# Altium project DSP-Control.PrjPcb
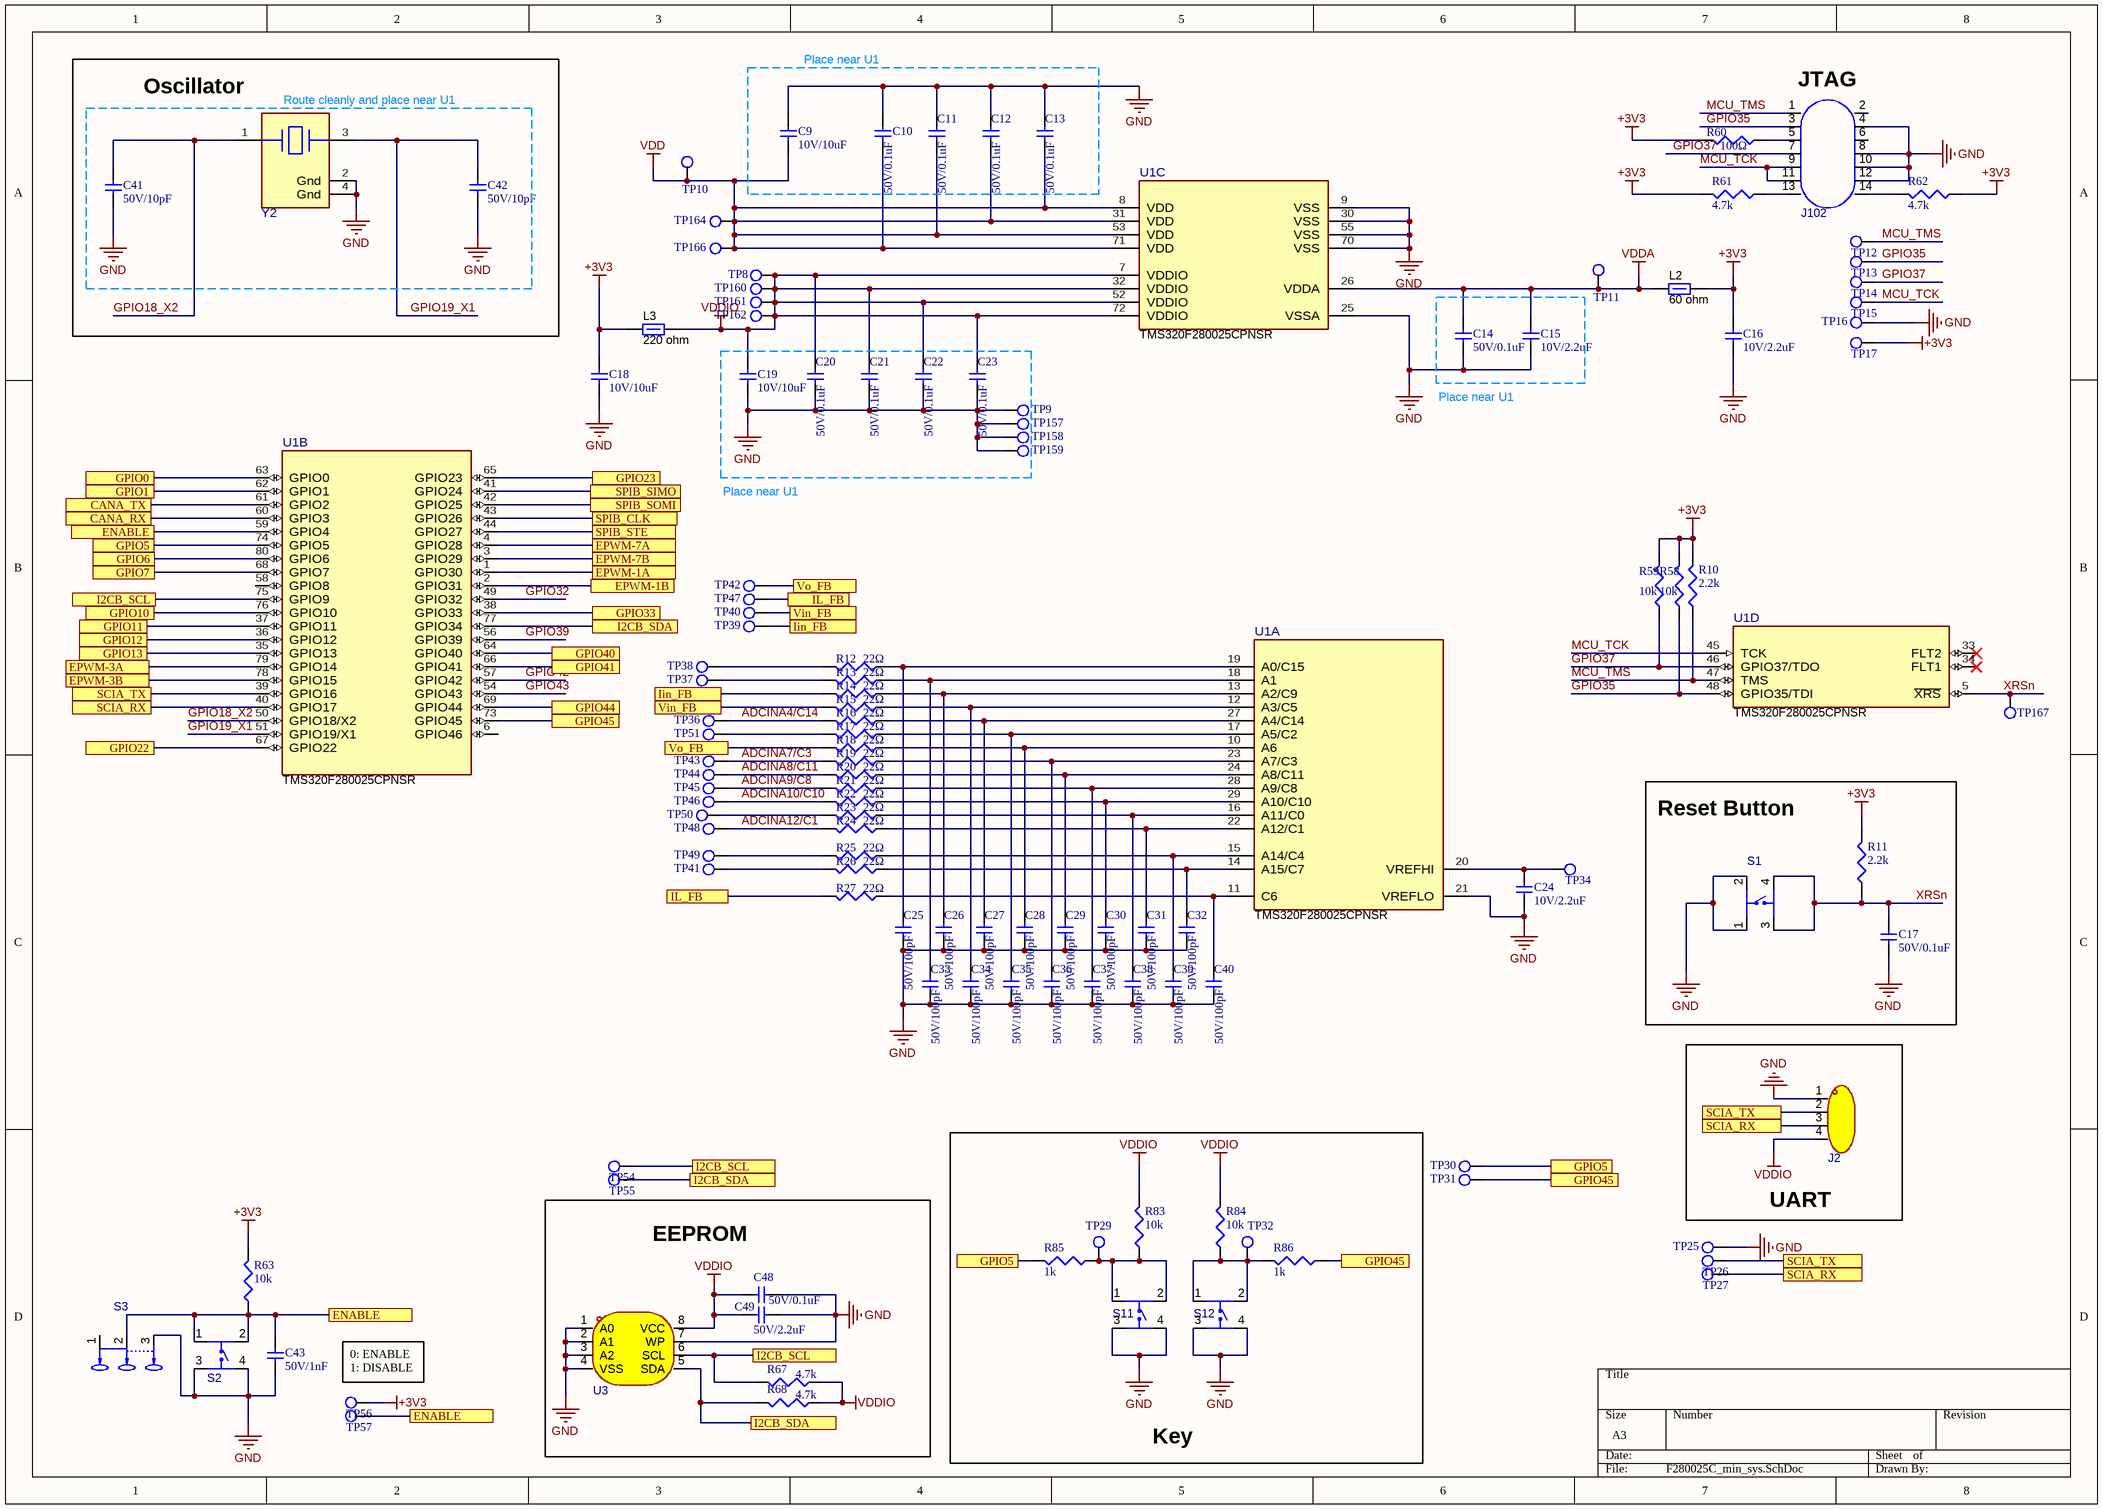
[diagram p0: F280025C_min_sys.SchDoc]
2 sheets, 225 parts. Net scope: global (net labels, ports and power ports of the same name join across sheets).
Board file: DSP_Control.PcbDoc
Sheets:
  F280025C_min_sys.SchDoc
  sys-part2.SchDoc

## Sheet F280025C_min_sys.SchDoc
size A3; SheetNumber: 1; SheetTotal: 2

### Parts
C9  10V/10uF  [C0603]
C10  50V/0.1uF  [C0603]
C11  50V/0.1uF  [C0603]
C12  50V/0.1uF  [C0603]
C13  50V/0.1uF  [C0603]
C14  50V/0.1uF  [C0603]
C15  10V/2.2uF  [C0603]
C16  10V/2.2uF  [C0603]
C17  50V/0.1uF  [C0603]
C18  10V/10uF  [C0603]
C19  10V/10uF  [C0603]
C20  50V/0.1uF  [C0603]
C21  50V/0.1uF  [C0603]
C22  50V/0.1uF  [C0603]
C23  50V/0.1uF  [C0603]
C24  10V/2.2uF  [C0603]
C25  50V/100pF  [C0603]
C26  50V/100pF  [C0603]
C27  50V/100pF  [C0603]
C28  50V/100pF  [C0603]
C29  50V/100pF  [C0603]
C30  50V/100pF  [C0603]
C31  50V/100pF  [C0603]
C32  50V/100pF  [C0603]
C33  50V/100pF  [C0603]
C34  50V/100pF  [C0603]
C35  50V/100pF  [C0603]
C36  50V/100pF  [C0603]
C37  50V/100pF  [C0603]
C38  50V/100pF  [C0603]
C39  50V/100pF  [C0603]
C40  50V/100pF  [C0603]
C41  50V/10pF  [C0603]
C42  50V/10pF  [C0603]
C43  50V/1nF  [C0603]
C48  50V/0.1uF  [C0603]
C49  50V/2.2uF  [C0805]
J2  pz254v-11-04p  [HDR-TH_4P-P2.54-V-M]  (value not drawn)
J102  2.54-2*7p简牛  [IDC-TH_14P-P2.54-V-R2-C7-S2.54]  (value not drawn)
L2  value 60 ohm  [L0805]  (hidden comment: 60Ω@100MHz)
L3  ValueDisplayed: 220 ohm  [L0805]  (hidden comment: 220Ω/100 MHz)
R10  2.2k  [R0603]
R11  2.2k  [R0603]
R12  22Ω  [R0603]
R13  22Ω  [R0603]
R14  22Ω  [R0603]
R15  22Ω  [R0603]
R16  22Ω  [R0603]
R17  22Ω  [R0603]
R18  22Ω  [R0603]
R19  22Ω  [R0603]
R20  22Ω  [R0603]
R21  22Ω  [R0603]
R22  22Ω  [R0603]
R23  22Ω  [R0603]
R24  22Ω  [R0603]
R25  22Ω  [R0603]
R26  22Ω  [R0603]
R27  22Ω  [R0603]
R58  10k  [R0603]
R59  10k  [R0603]
R60  100Ω  [R0603]
R61  4.7k  [R0603]
R62  4.7k  [R0603]
R63  10k  [R0603]
R67  4.7k  [R0603]
R68  4.7k  [R0603]
R83  10k  [R0603]
R84  10k  [R0603]
R85  1k  [R0603]
R86  1k  [R0603]
S1  kh-6x6x5h-stm  [SW-SMD_4P-L6.0-W6.0-P4.50-LS9.0_H5.0]  (value not drawn)
S2  kh-6x6x5h-stm  [SW-SMD_4P-L6.0-W6.0-P4.50-LS9.0_H5.0]  (value not drawn)
S3  ss-12d10l5  [SW-TH_SS-12D10L5]  (value not drawn)
S11  kh-6x6x5h-stm  [SW-SMD_4P-L6.0-W6.0-P4.50-LS9.0_H5.0]  (value not drawn)
S12  kh-6x6x5h-stm  [SW-SMD_4P-L6.0-W6.0-P4.50-LS9.0_H5.0]  (value not drawn)
TP8  TEST POINT  [TP-1.5]  (value not drawn)
TP9  TP-pad0.8  [PAD0.8/1.6]  (value not drawn)
TP10  TEST POINT  [TP-1.5]  (value not drawn)
TP11  TEST POINT  [TP-1.5]  (value not drawn)
TP12  TEST POINT  [TP-1.5]  (value not drawn)
TP13  TEST POINT  [TP-1.5]  (value not drawn)
TP14  TEST POINT  [TP-1.5]  (value not drawn)
TP15  TEST POINT  [TP-1.5]  (value not drawn)
TP16  TP-pad0.8  [PAD0.8/1.6]  (value not drawn)
TP17  TEST POINT  [TP-1.5]  (value not drawn)
TP25  TP-pad0.8  [PAD0.8/1.6]  (value not drawn)
TP26  TEST POINT  [TP-1.5]  (value not drawn)
TP27  TEST POINT  [TP-1.5]  (value not drawn)
TP29  TEST POINT  [TP-1.5]  (value not drawn)
TP30  TEST POINT  [TP-1.5]  (value not drawn)
TP31  TEST POINT  [TP-1.5]  (value not drawn)
TP32  TEST POINT  [TP-1.5]  (value not drawn)
TP34  TEST POINT  [TP-1.5]  (value not drawn)
TP36  TP-pad0.8  [PAD0.8/1.6]  (value not drawn)
TP37  TP-pad0.8  [PAD0.8/1.6]  (value not drawn)
TP38  TP-pad0.8  [PAD0.8/1.6]  (value not drawn)
TP39  TP-pad0.8  [PAD0.8/1.6]  (value not drawn)
TP40  TP-pad0.8  [PAD0.8/1.6]  (value not drawn)
TP41  TP-pad0.8  [PAD0.8/1.6]  (value not drawn)
TP42  TP-pad0.8  [PAD0.8/1.6]  (value not drawn)
TP43  TP-pad0.8  [PAD0.8/1.6]  (value not drawn)
TP44  TP-pad0.8  [PAD0.8/1.6]  (value not drawn)
TP45  TP-pad0.8  [PAD0.8/1.6]  (value not drawn)
TP46  TP-pad0.8  [PAD0.8/1.6]  (value not drawn)
TP47  TP-pad0.8  [PAD0.8/1.6]  (value not drawn)
TP48  TP-pad0.8  [PAD0.8/1.6]  (value not drawn)
TP49  TP-pad0.8  [PAD0.8/1.6]  (value not drawn)
TP50  TP-pad0.8  [PAD0.8/1.6]  (value not drawn)
TP51  TP-pad0.8  [PAD0.8/1.6]  (value not drawn)
TP54  TEST POINT  [TP-1.5]  (value not drawn)
TP55  TEST POINT  [TP-1.5]  (value not drawn)
TP56  TEST POINT  [TP-1.5]  (value not drawn)
TP57  TEST POINT  [TP-1.5]  (value not drawn)
TP157  TP-pad0.8  [PAD0.8/1.6]  (value not drawn)
TP158  TP-pad0.8  [PAD0.8/1.6]  (value not drawn)
TP159  TP-pad0.8  [PAD0.8/1.6]  (value not drawn)
TP160  TEST POINT  [TP-1.5]  (value not drawn)
TP161  TEST POINT  [TP-1.5]  (value not drawn)
TP162  TEST POINT  [TP-1.5]  (value not drawn)
TP164  TEST POINT  [TP-1.5]  (value not drawn)
TP166  TEST POINT  [TP-1.5]  (value not drawn)
TP167  TEST POINT  [TP-1.5]  (value not drawn)
U1  TMS320F280025CPNSR  [PN0080A-MFG]  (parts A,B,C,D of 4)
U3  24lc64t-i/sn  [SOIC-8_L4.9-W3.9-P1.27-LS6.0-BL]  (value not drawn)
Y2  20M  [CRYSTAL-SMD_4P-L3.2-W2.5-BL-2]  (value not drawn)

### Blocks framed on the sheet
Oscillator: C41 C42 Y2
Reset Button: C17 R11 S1
UART: J2
Key: R83-R86 S11 S12 TP29 TP32
EEPROM: C48 C49 R67 R68 U3

### Ports
CANA_RX, CANA_TX, ENABLE, EPWM-1A, EPWM-1B, EPWM-3A, EPWM-3B, EPWM-7A, EPWM-7B, GPIO0, GPIO1, GPIO5, GPIO6, GPIO7, GPIO10, GPIO11, GPIO12, GPIO13, GPIO22, GPIO23, GPIO33, GPIO40, GPIO41, GPIO44, GPIO45, I2CB_SCL, I2CB_SDA, Iin_FB, IL_FB, SCIA_RX, SCIA_TX, SPIB_CLK, SPIB_SIMO, SPIB_SOMI, SPIB_STE, Vin_FB, Vo_FB

### Nets
+3V3: C16.1 C18.1 L2.2 L3.1 R10.2 R11.2 R58.2 R59.2 R60.2 R61.2 R62.1 R63.2 TP17.1 TP56.1
GND: C9.1 C10.1 C11.1 C12.1 C13.1 C14.2 C15.2 C16.2 C17.2 C18.2 C19.2 C20.2 C21.2 C22.2 C23.2 C24.2 C25.2 C26.2 C27.2 C28.2 C29.2 C30.2 C31.2 C32.2 C33.2 C34.2 C35.2 C36.2 C37.2 C38.2 C39.2 C40.2 C41.2 C42.2 C43.2 C48.2 C49.2 J2.1 J102.4 J102.8 J102.10 J102.12 S1.1 S1.2 S2.3 S2.4 S3.3 S11.3 S11.4 S12.3 S12.4 TP9.1 TP16.1 TP25.1 TP157.1 TP158.1 TP159.1 U1.9(VSS) U1.21(VREFLO) U1.25(VSSA) U1.30(VSS) U1.55(VSS) U1.70(VSS) U3.1(A0) U3.2(A1) U3.3(A2) U3.4(VSS) U3.7(WP) Y2.2(Gnd) Y2.4(Gnd)
VDD: C9.2 C10.2 C11.2 C12.2 C13.2 TP10.1 TP164.1 TP166.1 U1.8(VDD) U1.31(VDD) U1.53(VDD) U1.71(VDD)
VDDA: C14.1 C15.1 L2.1 TP11.1 U1.26(VDDA)
VDDIO: C19.1 C20.1 C21.1 C22.1 C23.1 C48.1 C49.1 J2.4 L3.2 R67.1 R68.1 R83.2 R84.2 TP8.1 TP160.1 TP161.1 TP162.1 U1.7(VDDIO) U1.32(VDDIO) U1.52(VDDIO) U1.72(VDDIO) U3.8(VCC)
ADCINA4/C14: R16.2 TP36.1
ADCINA7/C3: R19.2 TP43.1
ADCINA8/C11: R20.2 TP44.1
ADCINA9/C8: R21.2 TP45.1
ADCINA10/C10: R22.2 TP46.1
ADCINA12/C1: R24.2 TP48.1
CANA_RX: U1.60(GPIO3) ; port CANA_RX
CANA_TX: U1.61(GPIO2) ; port CANA_TX
ENABLE: C43.1 R63.1 S2.1 S2.2 S3.2 TP57.1 U1.59(GPIO4) ; port ENABLE
EPWM-1A: U1.1(GPIO30) ; port EPWM-1A
EPWM-1B: U1.2(GPIO31) ; port EPWM-1B
EPWM-3A: U1.79(GPIO14) ; port EPWM-3A
EPWM-3B: U1.78(GPIO15) ; port EPWM-3B
EPWM-7A: U1.4(GPIO28) ; port EPWM-7A
EPWM-7B: U1.3(GPIO29) ; port EPWM-7B
GPIO0: U1.63(GPIO0) ; port GPIO0
GPIO1: U1.62(GPIO1) ; port GPIO1
GPIO5: R85.2 TP30.1 U1.74(GPIO5) ; port GPIO5
GPIO6: U1.80(GPIO6) ; port GPIO6
GPIO7: U1.68(GPIO7) ; port GPIO7
GPIO10: U1.76(GPIO10) ; port GPIO10
GPIO11: U1.37(GPIO11) ; port GPIO11
GPIO12: U1.36(GPIO12) ; port GPIO12
GPIO13: U1.35(GPIO13) ; port GPIO13
GPIO18_X2: C41.1 U1.50(GPIO18/X2) Y2.1(In/Out)
GPIO19_X1: C42.1 U1.51(GPIO19/X1) Y2.3(Out/In)
GPIO22: U1.67(GPIO22) ; port GPIO22
GPIO23: U1.65(GPIO23) ; port GPIO23
GPIO32: U1.49(GPIO32)
GPIO33: U1.38(GPIO33) ; port GPIO33
GPIO35: J102.3 R58.1 TP13.1 U1.48(GPIO35/TDI)
GPIO37: J102.7 R59.1 TP14.1 U1.46(GPIO37/TDO)
GPIO39: U1.56(GPIO39)
GPIO40: U1.64(GPIO40) ; port GPIO40
GPIO41: U1.66(GPIO41) ; port GPIO41
GPIO42: U1.57(GPIO42)
GPIO43: U1.54(GPIO43)
GPIO44: U1.69(GPIO44) ; port GPIO44
GPIO45: R86.1 TP31.1 U1.73(GPIO45) ; port GPIO45
I2CB_SCL: R67.2 TP54.1 U1.75(GPIO9) U3.6(SCL) ; port I2CB_SCL
I2CB_SDA: R68.2 TP55.1 U1.77(GPIO34) U3.5(SDA) ; port I2CB_SDA
Iin_FB: R14.2 TP39.1 ; port Iin_FB
IL_FB: R27.2 TP47.1 ; port IL_FB
MCU_TCK: J102.9 J102.11 TP15.1 U1.45(TCK)
MCU_TMS: J102.1 R10.1 TP12.1 U1.47(TMS)
SCIA_RX: J2.3 TP27.1 U1.40(GPIO17) ; port SCIA_RX
SCIA_TX: J2.2 TP26.1 U1.39(GPIO16) ; port SCIA_TX
SPIB_CLK: U1.43(GPIO26) ; port SPIB_CLK
SPIB_SIMO: U1.41(GPIO24) ; port SPIB_SIMO
SPIB_SOMI: U1.42(GPIO25) ; port SPIB_SOMI
SPIB_STE: U1.44(GPIO27) ; port SPIB_STE
Vin_FB: R15.2 TP40.1 ; port Vin_FB
Vo_FB: R18.2 TP42.1 ; port Vo_FB
XRSn: C17.1 R11.1 S1.3 S1.4 TP167.1 U1.5(~{XRS})
NetC24_1: C24.1 TP34.1 U1.20(VREFHI)
NetC25_1: C25.1 R12.1 U1.19(A0/C15)
NetC26_1: C26.1 R14.1 U1.13(A2/C9)
NetC27_1: C27.1 R16.1 U1.27(A4/C14)
NetC28_1: C28.1 R18.1 U1.10(A6)
NetC29_1: C29.1 R20.1 U1.24(A8/C11)
NetC30_1: C30.1 R22.1 U1.29(A10/C10)
NetC31_1: C31.1 R24.1 U1.22(A12/C1)
NetC32_1: C32.1 R26.1 U1.14(A15/C7)
NetC33_1: C33.1 R13.1 U1.18(A1)
NetC34_1: C34.1 R15.1 U1.12(A3/C5)
NetC35_1: C35.1 R17.1 U1.17(A5/C2)
NetC36_1: C36.1 R19.1 U1.23(A7/C3)
NetC37_1: C37.1 R21.1 U1.28(A9/C8)
NetC38_1: C38.1 R23.1 U1.16(A11/C0)
NetC39_1: C39.1 R25.1 U1.15(A14/C4)
NetC40_1: C40.1 R27.1 U1.11(C6)
NetJ102_5: J102.5 R60.1
NetJ102_13: J102.13 R61.1
NetJ102_14: J102.14 R62.2
NetR12_2: R12.2 TP38.1
NetR13_2: R13.2 TP37.1
NetR17_2: R17.2 TP51.1
NetR23_2: R23.2 TP50.1
NetR25_2: R25.2 TP49.1
NetR26_2: R26.2 TP41.1
NetR83_1: R83.1 R85.1 S11.1 S11.2 TP29.1
NetR84_1: R84.1 R86.2 S12.1 S12.2 TP32.1

Not connected (* = marked no-connect by the designer): J102 2 6; S3 1; U1 6(GPIO46) 33(FLT2)* 34(FLT1)* 58(GPIO8)

### Notes on the sheet
- (near Y2) Route cleanly and place near U1
- Place near U1
- (near J102) JTAG
- 0: ENABLE
- 1: DISABLE

### Library data of the parts
C9 C18 C19 = C0603-10V/10uF: 0603,10V/10uF
C10-C14 C17 C20-C23 C48 = C0603-50V/104: 0603,50V/104
C15 C16 C24 = C0603-10V/2.2uF: 0603,10V/2.2uF
C25-C40 = C0603-50V/100pF: 0603,50V/100pF
C41 C42 = C0603-50V/10pF: 0603,50V/10pF,C0G/NP0
C43 = C0603-50V/1nF: 0603,50V/1nF
C49 = C0805-50V/2.2uF: 0805,50V/2.2uF,
J2 = pz254v-11-04p: 插针结构:1x4P;间距:2.54mm;行距:-;圆针/方针:方针;安装方式:直插;排数:单排;总PIN位数:4P;额定电流:3A;额定电压:250V;配合针长度:6mm;塑高:2.5mm;端接针长度:3mm;触头材质:-;工作温度:-40℃~+105℃;颜色:黑色;; Manufacturer: XFCN(兴飞); Symbol: PZ254V-11-04P_C2691448; AddInBom: yes; ModelId: 112f4d05e8d64e99ab9a333894bea4f9; ModelName: HDR-TH_4P-P2.54-M-LI-1X4P; ModelTransform: 399.999,104.7242,0,0,0,0,0,0,-118.11; Pin Structure: 1x4P; Pitch: 2.54mm; Circluar Pins/Square Pins: 方针; Current Rating: 3A; Voltage Rating (Max): 250V; LCSC Part Name: 1x4P 间距:2.54mm 方针 直插; SupplierPart: C2691448; ManufacturerPart: PZ254V-11-04P; Supplier Footprint: 插件,P=2.54mm; JLCPCB Part Class: Extended Part; Datasheet: https://item.szlcsc.com/datasheet/PZ254V-11-04P/2801085.html; Supplier: LCSC; ConvertToPcb: yes; FootprintName: HDR-TH_4P-P2.54-V-M; Row Spacing: -; Mounting Type: 直插; Number of Rows: 单排; Number of Pins: 4P; Length of Mating Pin: 6mm; Insulation Height: 2.5mm; Length of End Connection Pin: 3mm; Contact Material: -; Operating Temperature: -40℃~+105℃; Color: 黑色
J102 = 2.54-2*7p简牛: 连接器类型:简牛座;间距:2.54mm;结构:2x7P;安装方式:直插;行距:2.54mm;排数:2;每排PIN数:7;触头材质:黄铜;触头镀层:金;; Manufacturer: BOOMELE(博穆精密); Symbol: HDR-IDC-2.54-2X7P; AddInBom: yes; ModelId: 1e191473481d43b08e40c7df32061c8c; ModelTransform: 999.998,348.41478,0,0,0,0,0,3.937,-118.11; Connector Type: 简牛座; Pitch: 2.54mm; Number of Positions or Pins: 2x7P; Holder Type: 直插; Number of PINs Per Row: 7; LCSC Part Name: 2.54mm 2x7P 排数:2 每排P数:7; SupplierPart: C11215; ManufacturerPart: 2.54-2*7P简牛; Supplier Footprint: 插件,P=2.54mm; JLCPCB Part Class: Extended Part; Datasheet: https://item.szlcsc.com/datasheet/2.54-2*7P%25E7%25AE%2580%25E7%2589%259B/11764.html; Supplier: LCSC; ConvertToPcb: yes; FootprintName: IDC-TH_14P-P2.54-V-R2-C7-S2.54; ModelName: IDC-TH_14P-P2.54-V-R2-C7-S2.54; Row Spacing: 2.54mm; Number of Rows: 2; Contact Material: 黄铜; Contact Plating: 金
L2 = 磁珠-60Ω@100MHz: 磁珠,60Ω@100MHz,3A,0805,CBW201209U600T,风华; Manufacturer: Wurth Elektronik; PartNumber: 742792063; Ztyp@1GHz_Ohm: 95.384; ZTyp@100MHz_Ohm: 60; SizeAreaWB_mm2: 6.75; DCR_ohm: 0.025; Value1: 0.025 ohm; SizeZ_mm: 1.45; SizeX_mm: 2; SizeY_mm: 1.25; SizeArea_mm2: 2.5; CompType: Ferrite Bead; ComponentLink1URL: http://katalog.we-online.de/pbs/datasheet/742792063.pdf; Supplier Part Number 2: 710-742792063; Publisher: Texas Instruments; Supplier 2: Mouser; Published: 2014-04-30; RoHS: Y; MountType: SMT; Supplier 1: Digi-Key; PackageReference: 0805; Imax_A: 3A; Value2: 3A; LatestRevisionDate: 2017-03-09; ComponentLink1Description: Datasheet link; Supplier Part Number 1: 732-1612-1-ND; ValueDisplayed: 60 ohm
L3 = 磁珠-220Ω-100MHz-2A: 磁珠 220Ω @ 100 MHz, 2 A, 0805,BLM21PG221SN1D，村田; Manufacturer: Wurth Elektronik; PartNumber: 742792022; Ztyp@1GHz_Ohm: 190.289; ZTyp@100MHz_Ohm: 220; SizeAreaWB_mm2: 6.75; DCR_ohm: 0.05; Value1: 0.05 ohm; Value: 220 ohm; Imax_A: 2A; SizeZ_mm: 1.45; SizeX_mm: 2; SizeY_mm: 1.25; SizeArea_mm2: 2.5; CompType: Ferrite Bead; ComponentLink1URL: http://katalog.we-online.de/pbs/datasheet/742792022.pdf; Supplier Part Number 2: 710-742792022; Publisher: Texas Instruments; Supplier 2: Mouser; Published: 2014-04-30; RoHS: Y; MountType: SMT; Supplier 1: Digi-Key; PackageReference: 0805; Value2: 2A; LatestRevisionDate: 2017-03-09; ComponentLink1Description: Datasheet link; Supplier Part Number 1: 732-1614-1-ND
R10 R11 = R0603-2.2k: 0603,2.2k
R12-R27 = R0603-22Ω: 0603,22Ω
R58 R59 R63 R83 R84 = R0603-10k: 0603,10k
R60 = R0603-100Ω: 0603,100Ω
R61 R62 R67 R68 = R0603-4.7k: 0603,4.7k
R85 R86 = R0603-1k: 0603,1k
S1 S2 S11 S12 = kh-6x6x5h-stm: 电路结构:单刀单掷;按钮形状:圆形按钮;安装方式:立贴;开关长度:6mm;开关宽度:6mm;开关高度:5mm;带支架:不带支架;触点电流:50mA;额定电压:12V;工作寿命:8万次;; Manufacturer: kinghelm(金航标); AddInBom: yes; ModelId: 46371efb35684031937580a0045530ec; ModelTransform: 354.33,236.25937,0,0,0,0,0,0,0; Circuit: 单刀单掷; Actuator Style: 圆形按钮; Switch Height: 5mm; with Bracket: 不带支架; Contact Current: 50mA; Voltage Rating: 12V; Actuator/Cap Color: 黑色; Life: 8万次; Symbol: KH-6X6X5H-STM; LCSC Part Name: 6*6*5mm 立贴 轻触开关; SupplierPart: C2837531; ManufacturerPart: KH-6X6X5H-STM; Supplier Footprint: SMD-4P,6x6mm; JLCPCB Part Class: Extended Part; Datasheet: https://item.szlcsc.com/datasheet/KH-6X6X5H-STM/3009601.html; Supplier: LCSC; ConvertToPcb: yes; FootprintName: SW-SMD_4P-L6.0-W6.0-P4.50-LS9.0_H5.0; ModelName: SW-SMD_4P-L6.0-W6.0-P4.50-LS9.0_H5.0; Mounting Type: 立贴; Length: 6mm; Width: 6mm; Termination Style: 鸥翼型
S3 = ss-12d10l5: 电路结构:单刀双掷;安装方式:直插;开关颜色:黑色;额定电流:3A;额定电压:125V;工作寿命:1万次;; Manufacturer: XKB Connection(中国星坤); AddInBom: yes; ModelId: c49f07a32c154ec8ad7cf47670a53981; ModelName: SW-TH_L13.0-W6.8-H6.4-P4.7; ModelTransform: 511.81394,267.716,0,0,0,0,0,0,-220.472; Circuit: 单刀双掷; Actuator Style: 矩形柱状; Switch Height: 6.4mm; Actuator Color: 黑色; Current Rating: 3A; Voltage Rating: 125V; Life: 1万次; Symbol: SS-12D10L5; LCSC Part Name: 柄长5mm 直插双档 滑动开关; SupplierPart: C319012; ManufacturerPart: SS-12D10L5; Supplier Footprint: 插件,13x6.8mm; JLCPCB Part Class: Extended Part; Datasheet: https://item.szlcsc.com/datasheet/SS-12D10L5/300104.html; Supplier: LCSC; ConvertToPcb: yes; FootprintName: SW-TH_SS-12D10L5; Termination Style: PC引脚; Length: 13mm; Width: 6.8mm; Mounting Type: 直插; Operating Temperature: -40℃~+85℃
U1 = SYM-TMS320F280025CPNSR: 32-bit MCU with 100 MHz, FPU, TMU, 128-KB flash, CLB 80-LQFP -40 to 125; Manufacturer: Texas Instruments; TJmax_C: +125°C; Number Of Spi Channels: 2; CompType: IC; Max Supply Voltage: 3.63V; Number Of Pwm Channels: 14; AEC Qualified: No; Memory Size: 128KBytes; Interface: I2C,SPI,UART,CAN,LIN,SCI,Other; Min Supply Voltage: 2.8V; SizeZ_mm: 1.6mm; Number Of Adc Channels: 16; Number Of Timers/Counters: 3; Ram Size: 24KBytes; Number Of Cores: 1; Frequency_Fixed: 100MHz; Number Of I/Os: 43; Data Bus Width: 32bits; Standoff Height: 0.05mm; Core Architecture: TMS320C28x; AEC Category: Q200; TaMin_C: -40°C; Number Of A/D Converters: 2; helpURL: https://upverter.com/upn/revision/e6f10be0003e77e0/; ComponentLink3Description: Online Datasheet; Memory Type: FLASH; ComponentLink3URL: http://www.ti.com/product/GPN/datasheet; ComponentLink1Description: Datasheet Link; ComponentLink2Description: Product Folder; Operating Temperature Range: -40°C to +125°C; Datasheet Path: datasheets/IC-TMS320F280025CPNSR.pdf; Number Of Uart Channels: 1; RoHS: UNKNOWN; Number Of I2C Channels: 2; TaMax_C: +125°C; PackageReference: LQFP80; Part Number: TMS320F280025CPNSR; ComponentLink1URL: http://www.ti.com/lit/ds/symlink/GPN.pdf; ComponentLink2URL: http://www.ti.com/product/GPN; PartId: 1; PartNumber: TMS320F280025CPNSR
U3 = 24lc64t-i/sn: 接口类型:I2C;存储容量:64Kbit;时钟频率(fc):400kHz;; Manufacturer: MICROCHIP(美国微芯); Symbol: 24LC64T-I/SN SOP-8; AddInBom: yes; ModelId: e81d2f7d937b4a6ab1dca543ff5d56a4; ModelName: SOIC-8_L4.9-W3.9-H1.7-LS6.0-P1.27; ModelTransform: 192.913,236.22,0,0,0,0,0,0,0; Interface: I2C; Memory Size: 64Kbit; Clock Frequency: 400kHz; Write Cycle Time(Tw): 5ms; Data Retention - TDR (Year): 200年; Write Cycle Endurance: 100万次; Voltage - Supply: 2.5V~5.5V; LCSC Part Name: 64K I²C 串行 EEPROM; SupplierPart: C5460; ManufacturerPart: 24LC64T-I/SN; Supplier Footprint: SOIC-8; JLCPCB Part Class: Extended Part; Datasheet: https://item.szlcsc.com/datasheet/24LC64T-I%252FSN/5911.html; Supplier: LCSC; ConvertToPcb: yes; FootprintName: SOIC-8_L4.9-W3.9-P1.27-LS6.0-BL; Features: 噪声抑制功能；硬件写保护功能; Operating Temperature: -40℃~+85℃
Y2 = 晶振-20M-X322520MSB4SI: 20M,X322520MSB4SI,扬兴,SMD3225-4P,常温频差:±10ppm;负载电容:20pF;频率稳定度:±20ppm;; PartNumber: ECS-200-8-30B-CKM; Manufacturer: ECS International; Tolerance_%: 10ppm; Frequency_Fixed: 20MHz; Esr: 40; AEC Qualified: No; Load Capacitance: 8pF; SizeZ_mm: 0.85mm; Datasheet Path: datasheets/Crys-ECS-200-8-30B-CKM.pdf; ComponentLink1URL: https://ecsxtal.com/store/pdf/ecx_53b.pdf; Supplier Part Number 1: XC1841CT-ND; Operating Temperature Range: -20°C to +70°C; PackageReference: SMD4; Mouser Part Number: 520-200-8-30B-CKM; ComponentLink1Description: Datasheet; Part Number: ECS-200-8-30B-CKM; Digikey Description: CRYSTAL 20.0000MHZ 8PF SMD; Supplier 2: Mouser; Mouser Description: Crystals 20.000MHZ 8pF 10ppm -20C +70C; Supplier 1: Digikey; Frequency Stability: 10ppm; datasheet: https://ecsxtal.com/store/pdf/ecx_53b.pdf; Frequency Tolerance: 10ppm; Digikey Part Number: XC1841CT-ND; Lead Free: Yes; helpURL: https://upverter.com/upn/revision/b9ae4a09c701963d/; RoHS: TRUE; Series: ECX-53B; Supplier Part Number 2: 520-200-8-30B-CKM

## Sheet sys-part2.SchDoc
size A3; SheetNumber: 2; SheetTotal: 2
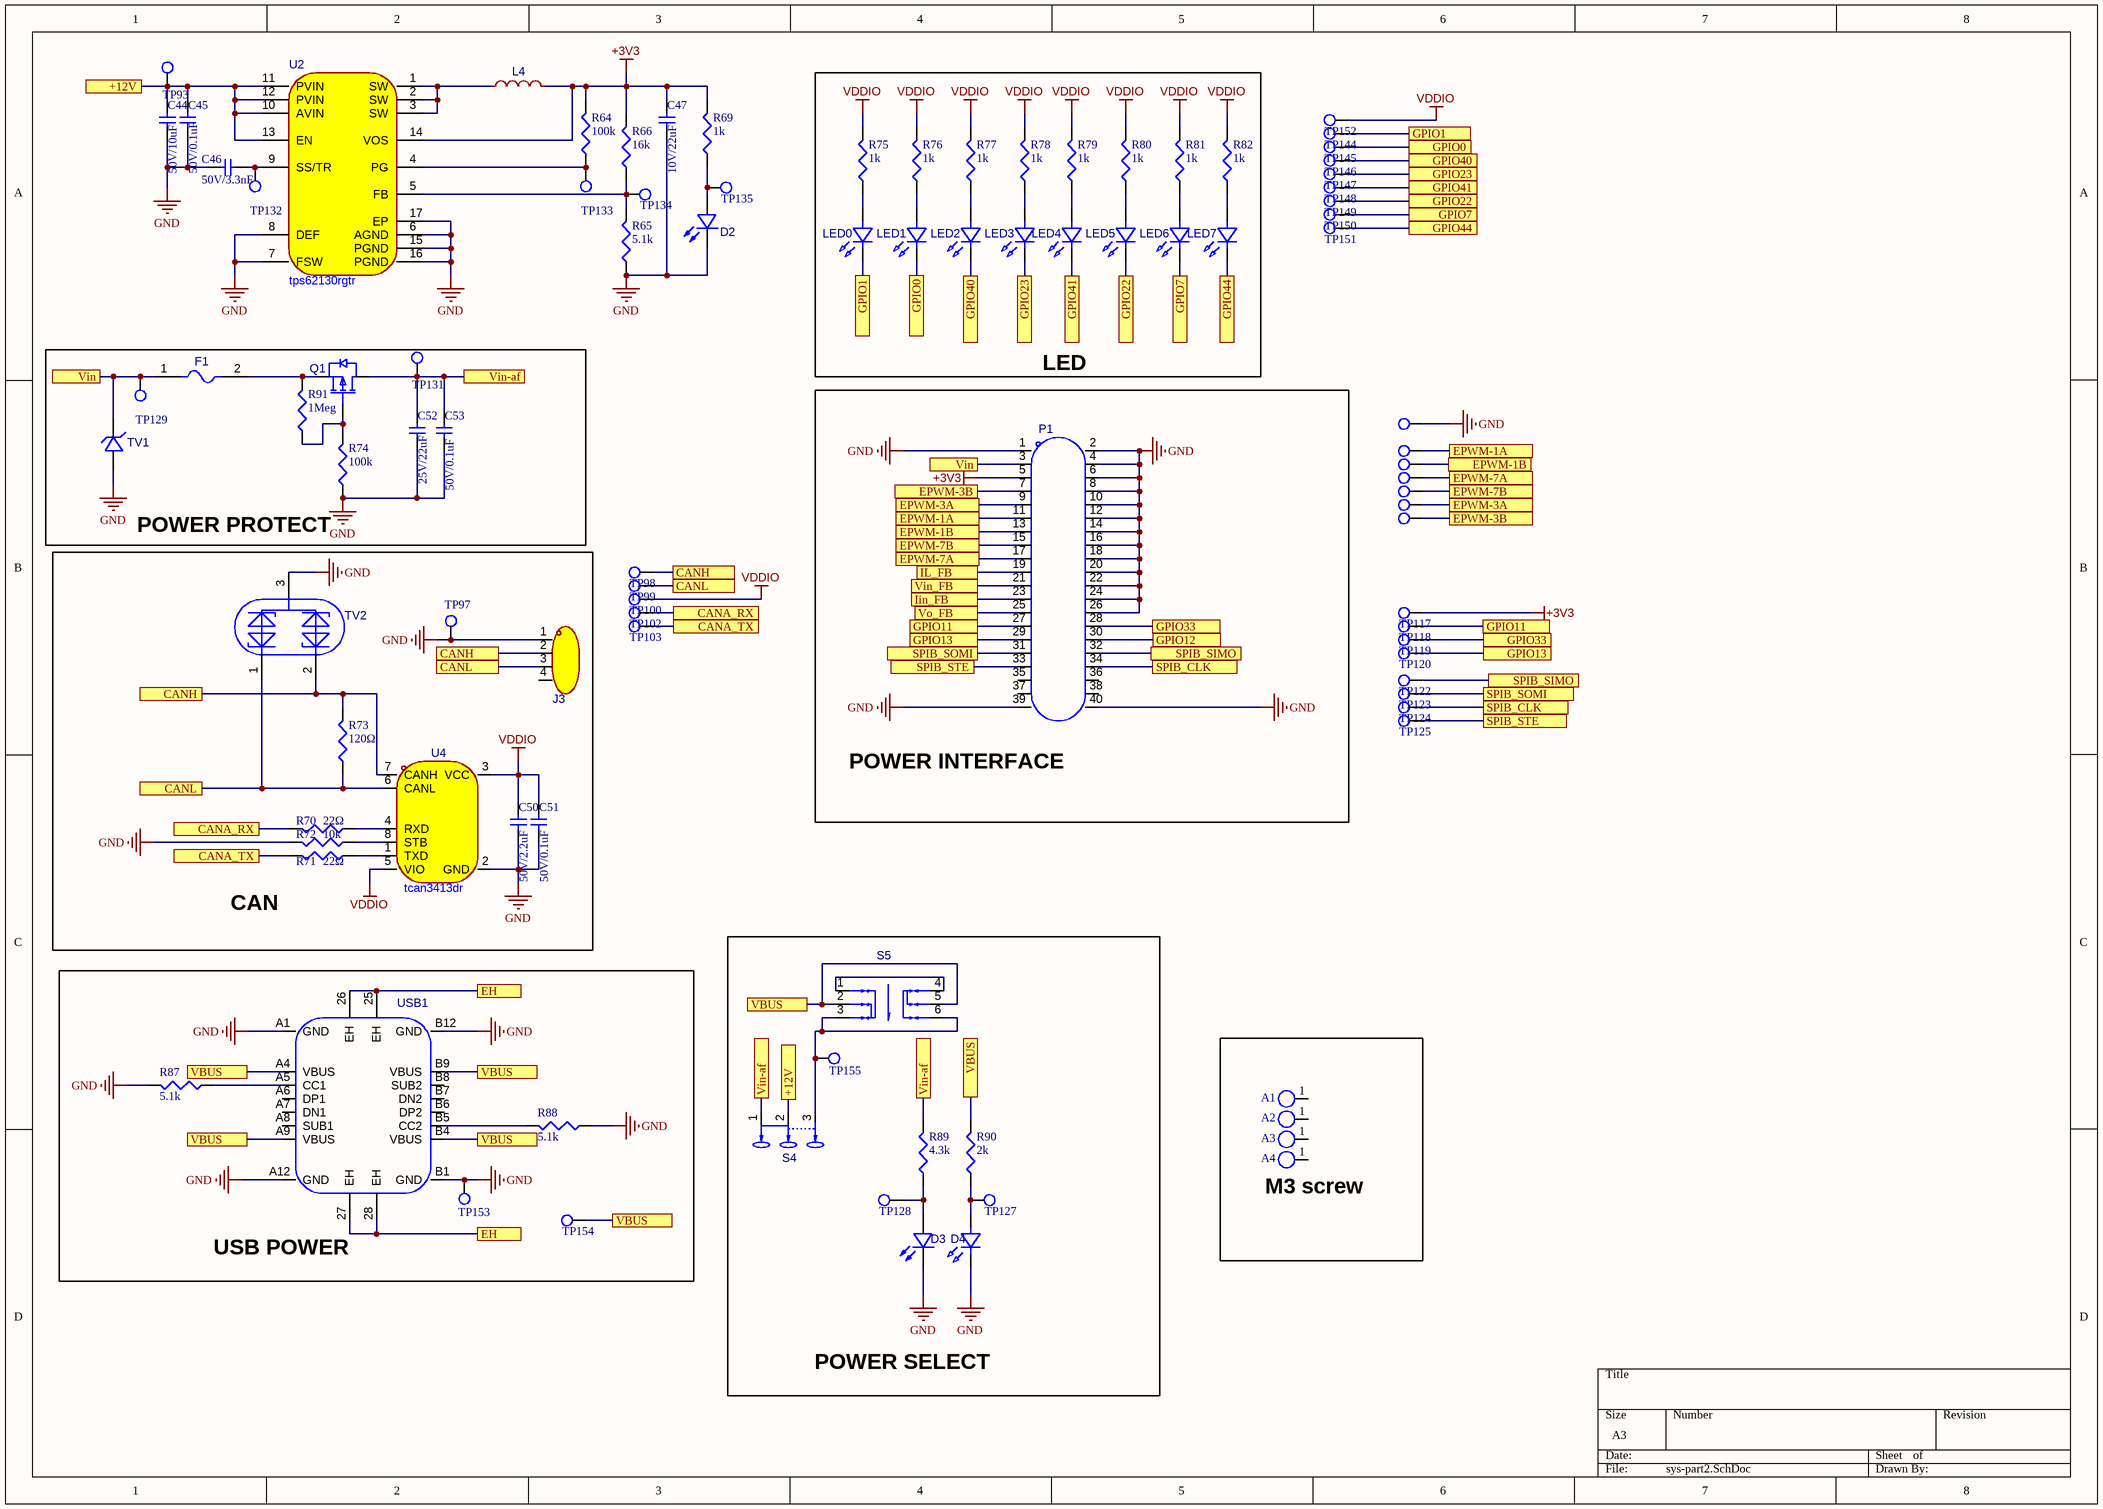
[diagram p1: sys-part2.SchDoc]

### Parts
A1  PAD-3.2/6.0  [PAD-3.2/6.0]  (value not drawn)
A2  PAD-3.2/6.0  [PAD-3.2/6.0]  (value not drawn)
A3  PAD-3.2/6.0  [PAD-3.2/6.0]  (value not drawn)
A4  PAD-3.2/6.0  [PAD-3.2/6.0]  (value not drawn)
C44  50V/10uF  [C0805]
C45  50V/0.1uF  [C0603]
C46  50V/3.3nF  [C0603]
C47  10V/22uF  [C0603]
C50  50V/2.2uF  [C0805]
C51  50V/0.1uF  [C0603]
C52  25V/22uF  [C0805]
C53  50V/0.1uF  [C0603]
D2  ncd0805c1  [LED0805-RD]  (value not drawn)
D3  ncd0805c1  [LED0805-RD]  (value not drawn)
D4  xl-2012surc  [LED0805-RD_RED]  (value not drawn)
F1  nsmd050-24v  [F1206]  (value not drawn)
J3  db125-3.81-4p-gn-s  [CONN-TH_DB125-3.81-4P]  (value not drawn)
L4  fhd4020s-3r3mt  [IND-SMD_L4.0-W4.0]  (value not drawn)
LED0  xl-2012surc  [LED0805-RD_RED]  (value not drawn)
LED1  xl-2012surc  [LED0805-RD_RED]  (value not drawn)
LED2  xl-2012surc  [LED0805-RD_RED]  (value not drawn)
LED3  xl-2012surc  [LED0805-RD_RED]  (value not drawn)
LED4  xl-2012surc  [LED0805-RD_RED]  (value not drawn)
LED5  xl-2012surc  [LED0805-RD_RED]  (value not drawn)
LED6  xl-2012surc  [LED0805-RD_RED]  (value not drawn)
LED7  xl-2012surc  [LED0805-RD_RED]  (value not drawn)
P1  zx-pm2.54-2-20py  [HDR-TH_40P-P2.54-V-F-R2-C20-S2.54]  (value not drawn)
Q1  ao3407a_c15155  [SOT-23-3_L2.9-W1.6-P1.90-LS2.8-BR]  (value not drawn)
R64  100k  [R0603]
R65  5.1k  [R0603]
R66  16k  [R0603]
R69  1k  [R0603]
R70  22Ω  [R0603]
R71  22Ω  [R0603]
R72  10k  [R0603]
R73  120Ω  [R0603]
R74  100k  [R0603]
R75  1k  [R0603]
R76  1k  [R0603]
R77  1k  [R0603]
R78  1k  [R0603]
R79  1k  [R0603]
R80  1k  [R0603]
R81  1k  [R0603]
R82  1k  [R0603]
R87  5.1k  [R0603]
R88  5.1k  [R0603]
R89  4.3k  [R0603]
R90  2k  [R0603]
R91  1Meg  [R0603]
S4  ss-12d10l5  [SW-TH_SS-12D10L5]  (value not drawn)
S5  xkb8080-z  [SW-TH_6P-L8.0-W8.0-P2.50]  (value not drawn)
TP93  TEST POINT  [TP-1.5]  (value not drawn)
TP97  TP-pad0.8  [PAD0.8/1.6]  (value not drawn)
TP98  TEST POINT  [TP-1.5]  (value not drawn)
TP99  TEST POINT  [TP-1.5]  (value not drawn)
TP100  TEST POINT  [TP-1.5]  (value not drawn)
TP102  TEST POINT  [TP-1.5]  (value not drawn)
TP103  TEST POINT  [TP-1.5]  (value not drawn)
TP104  TP-pad0.8  [PAD0.8/1.6]  (value not drawn)
TP105  TP-pad0.8  [PAD0.8/1.6]  (value not drawn)
TP106  TP-pad0.8  [PAD0.8/1.6]  (value not drawn)
TP107  TP-pad0.8  [PAD0.8/1.6]  (value not drawn)
TP108  TP-pad0.8  [PAD0.8/1.6]  (value not drawn)
TP109  TP-pad0.8  [PAD0.8/1.6]  (value not drawn)
TP110  TP-pad0.8  [PAD0.8/1.6]  (value not drawn)
TP117  TEST POINT  [TP-1.5]  (value not drawn)
TP118  TEST POINT  [TP-1.5]  (value not drawn)
TP119  TEST POINT  [TP-1.5]  (value not drawn)
TP120  TEST POINT  [TP-1.5]  (value not drawn)
TP122  TEST POINT  [TP-1.5]  (value not drawn)
TP123  TEST POINT  [TP-1.5]  (value not drawn)
TP124  TEST POINT  [TP-1.5]  (value not drawn)
TP125  TEST POINT  [TP-1.5]  (value not drawn)
TP127  TEST POINT  [TP-1.5]  (value not drawn)
TP128  TEST POINT  [TP-1.5]  (value not drawn)
TP129  TEST POINT  [TP-1.5]  (value not drawn)
TP131  TEST POINT  [TP-1.5]  (value not drawn)
TP132  TEST POINT  [TP-1.5]  (value not drawn)
TP133  TEST POINT  [TP-1.5]  (value not drawn)
TP134  TEST POINT  [TP-1.5]  (value not drawn)
TP135  TEST POINT  [TP-1.5]  (value not drawn)
TP144  TEST POINT  [TP-1.5]  (value not drawn)
TP145  TEST POINT  [TP-1.5]  (value not drawn)
TP146  TEST POINT  [TP-1.5]  (value not drawn)
TP147  TEST POINT  [TP-1.5]  (value not drawn)
TP148  TEST POINT  [TP-1.5]  (value not drawn)
TP149  TEST POINT  [TP-1.5]  (value not drawn)
TP150  TEST POINT  [TP-1.5]  (value not drawn)
TP151  TEST POINT  [TP-1.5]  (value not drawn)
TP152  TEST POINT  [TP-1.5]  (value not drawn)
TP153  TP-pad0.8  [PAD0.8/1.6]  (value not drawn)
TP154  TEST POINT  [TP-1.5]  (value not drawn)
TP155  TP-pad0.8  [PAD0.8/1.6]  (value not drawn)
TV1  smbj15a_c83846  [SMB_L4.6-W3.6-LS5.3-RD]  (value not drawn)
TV2  pesd1can,215  [SOT-23_L2.9-W1.3-P1.90-LS2.4-BR]  (value not drawn)
U2  tps62130rgtr  [QFN-16_L3.0-W3.0-P0.50-TL-EP1.7]
U4  tcan3413dr  [SOP-8_L4.9-W3.9-P1.27-LS6.0-BL-1]
USB1  type-c 16p cb1.6 073  [USB-C-SMD_SHOU_TYPE-C-16P-CB1.6]  (value not drawn)

### Blocks framed on the sheet
LED: LED0-LED7 R75-R82
POWER PROTECT: C52 C53 F1 Q1 R74 R91 TP129 TP131 TV1
POWER INTERFACE: P1
CAN: C50 C51 J3 R70-R73 TP97 TV2 U4
USB POWER: R87 R88 TP153 TP154 USB1
POWER SELECT: D3 D4 R89 R90 S4 S5 TP127 TP128 TP155
M3 screw: A1-A4

### Ports
+12V, CANA_RX, CANA_TX, CANH, CANL, EH, EPWM-1A, EPWM-1B, EPWM-3A, EPWM-3B, EPWM-7A, EPWM-7B, GPIO0, GPIO1, GPIO7, GPIO11, GPIO12, GPIO13, GPIO22, GPIO23, GPIO33, GPIO40, GPIO41, GPIO44, Iin_FB, IL_FB, SPIB_CLK, SPIB_SIMO, SPIB_SOMI, SPIB_STE, VBUS, Vin, Vin-af, Vin_FB, Vo_FB

### Nets
+3V3: C47.1 L4.2 P1.5 R64.2 R66.2 R69.2 TP117.1 U2.14(VOS)
GND: C44.2 C45.2 C46.1 C47.2 C50.2 C51.2 C52.2 C53.2 D2.1(K) D3.1(K) D4.1(K) J3.1 P1.1 P1.2 P1.4 P1.6 P1.8 P1.10 P1.12 P1.14 P1.16 P1.18 P1.20 P1.22 P1.24 P1.26 P1.39 P1.40 R65.1 R72.2 R74.1 R87.2 R88.1 TP97.1 TP104.1 TP153.1 TV1.2 TV2.3 U2.6(AGND) U2.7(FSW) U2.8(DEF) U2.15(PGND) U2.16(PGND) U2.17(EP) U4.2(GND) USB1.A1(GND) USB1.A12(GND) USB1.B1(GND) USB1.B12(GND)
VDDIO: C50.1 C51.1 R75.2 R76.2 R77.2 R78.2 R79.2 R80.2 R81.2 R82.2 TP100.1 TP152.1 U4.3(VCC) U4.5(VIO)
+12V: C44.1 C45.1 S4.2 TP93.1 U2.10(AVIN) U2.11(PVIN) U2.12(PVIN) U2.13(EN) ; port +12V
CANA_RX: R70.2 TP102.1 ; port CANA_RX
CANA_TX: R71.2 TP103.1 ; port CANA_TX
CANH: J3.2 R73.2 TP98.1 TV2.2 U4.7(CANH) ; port CANH
CANL: J3.3 R73.1 TP99.1 TV2.1 U4.6(CANL) ; port CANL
EH: USB1.25(EH) USB1.26(EH) USB1.27(EH) USB1.28(EH) ; port EH
EPWM-1A: P1.11 TP105.1 ; port EPWM-1A
EPWM-1B: P1.13 TP106.1 ; port EPWM-1B
EPWM-3A: P1.9 TP109.1 ; port EPWM-3A
EPWM-3B: P1.7 TP110.1 ; port EPWM-3B
EPWM-7A: P1.17 TP107.1 ; port EPWM-7A
EPWM-7B: P1.15 TP108.1 ; port EPWM-7B
GPIO0: LED1.1(K) TP145.1 ; port GPIO0
GPIO1: LED0.1(K) TP144.1 ; port GPIO1
GPIO7: LED6.1(K) TP150.1 ; port GPIO7
GPIO11: P1.27 TP118.1 ; port GPIO11
GPIO12: P1.30 ; port GPIO12
GPIO13: P1.29 TP120.1 ; port GPIO13
GPIO22: LED5.1(K) TP149.1 ; port GPIO22
GPIO23: LED3.1(K) TP147.1 ; port GPIO23
GPIO33: P1.28 TP119.1 ; port GPIO33
GPIO40: LED2.1(K) TP146.1 ; port GPIO40
GPIO41: LED4.1(K) TP148.1 ; port GPIO41
GPIO44: LED7.1(K) TP151.1 ; port GPIO44
Iin_FB: P1.23 ; port Iin_FB
IL_FB: P1.19 ; port IL_FB
SPIB_CLK: P1.34 TP124.1 ; port SPIB_CLK
SPIB_SIMO: P1.32 TP122.1 ; port SPIB_SIMO
SPIB_SOMI: P1.31 TP123.1 ; port SPIB_SOMI
SPIB_STE: P1.33 TP125.1 ; port SPIB_STE
VBUS: R90.2 S5.2 S5.5 TP154.1 USB1.A4(VBUS) USB1.A9(VBUS) USB1.B4(VBUS) USB1.B9(VBUS) ; port VBUS
Vin: F1.1 P1.3 TP129.1 TV1.1 ; port Vin
Vin-af: C52.1 C53.1 Q1.3(D) R89.2 S4.1 TP131.1 ; port Vin-af
Vin_FB: P1.21 ; port Vin_FB
Vo_FB: P1.25 ; port Vo_FB
NetC46_2: C46.2 TP132.1 U2.9(SS/TR)
NetD2_2: D2.2(A) R69.1 TP135.1
NetD3_2: D3.2(A) R89.1 TP128.1
NetD4_2: D4.2(A) R90.1 TP127.1
NetF1_2: F1.2 Q1.2(S) R91.2
NetL4_1: L4.1 U2.1(SW) U2.2(SW) U2.3(SW)
NetLED0_2: LED0.2(A) R75.1
NetLED1_2: LED1.2(A) R76.1
NetLED2_2: LED2.2(A) R77.1
NetLED3_2: LED3.2(A) R78.1
NetLED4_2: LED4.2(A) R79.1
NetLED5_2: LED5.2(A) R80.1
NetLED6_2: LED6.2(A) R81.1
NetLED7_2: LED7.2(A) R82.1
NetQ1_1: Q1.1(G) R74.2 R91.1
NetR64_1: R64.1 TP133.1 U2.4(PG)
NetR65_2: R65.2 R66.1 TP134.1 U2.5(FB)
NetR70_1: R70.1 U4.4(RXD)
NetR71_1: R71.1 U4.1(TXD)
NetR72_1: R72.1 U4.8(STB)
NetR87_1: R87.1 USB1.A5(CC1)
NetR88_2: R88.2 USB1.B5(CC2)
NetS4_3: S4.3 S5.3 S5.6 TP155.1
NetS5_1: S5.1 S5.4

Not connected (* = marked no-connect by the designer): A1 1; A2 1; A3 1; A4 1; J3 4; P1 35 36 37 38; USB1 A6(DP1) A7(DN1) A8(SUB1) B6(DP2) B7(DN2) B8(SUB2)

### Library data of the parts
C44 = C0805-50V/10uF: 0805,50V/10uF,
C45 C51 C53 = C0603-50V/104: 0603,50V/104
C46 = C0603-50V/3.3nF: 0603,50V/3.3nF
C47 = C0603-10V/22uF: 0603,10V/22uF
C50 = C0805-50V/2.2uF: 0805,50V/2.2uF,
C52 = C0805-25V/22uF: 0805,25V/22uF,
D2 D3 = ncd0805c1: 灯头类型:-;发光颜色:黄绿色;正向压降(Vf):1.6V~2.6V;功率:65mW;正向电流:25mA;波长:565nm~578nm;二极管配置:独立二极管;透镜颜色:-;色温:-;发光强度:55mcd;发光角度:130°;载带方式:-;工作温度:-30℃~+85℃;; Manufacturer: 国星光电; Symbol: FC-2012GHK-570A08; AddInBom: yes; ModelId: b1c5ed7a4f6e46d3bc6f6cc7c20f3fea; ModelTransform: 79.527,49.2125,0,0,0,0,0,0,0; Illumination Color: 黄绿色; Power(Watts): 65mW; Forward Current: 25mA; Peak Wavelength: 576nm; Diode Configuration: 独立二极管; Luminous Intensity: 55mcd; Viewing Angle: 130°; LCSC Part Name: 片式发光二极管; SupplierPart: C84257; ManufacturerPart: NCD0805C1; Supplier Footprint: 0805; JLCPCB Part Class: Extended Part; Datasheet: https://item.szlcsc.com/datasheet/NCD0805C1/85426.html; Supplier: LCSC; ConvertToPcb: yes; FootprintName: LED0805-RD; ModelName: LED0805-RD; Lamp Holder Type: -; Voltage - Forward(Vf): 1.6V~2.6V; Wavelength - Dominant: 565nm~578nm; Lens Color: -; Color Temperature: -; Mounting Style: -; Operating Temperature: -30℃~+85℃
D4 LED0-LED7 = xl-2012surc: 灯头类型:2mmx1.2mm方形灯头;发光颜色:红色;正向压降(Vf):2.3V;功率:50mW;正向电流:20mA;波长:615nm~630nm;二极管配置:独立二极管;透镜颜色:无色透明透镜;色温:-;发光强度:230mcd;发光角度:120°;载带方式:正贴;工作温度:-40℃~+85℃;; Manufacturer: XINGLIGHT(成兴光); AddInBom: yes; ModelId: 9e1095fac56a47ba900124c2261595bd; ModelTransform: 79.527,49.2125,0,0,0,0,0,-0.004,0; Illumination Color: 红色; Voltage - Forward(Vf): 2.3V; Power(Watts): 50mW; Forward Current: 20mA; Peak Wavelength: 620nm; Diode Configuration: 独立二极管; Lens Color: 无色透明透镜; Luminous Intensity: 230mcd; Viewing Angle: 120°; Symbol: XL-2012SURC; LCSC Part Name: 0805红贴片式发光二极管; SupplierPart: C965812; ManufacturerPart: XL-2012SURC; Supplier Footprint: 0805; JLCPCB Part Class: Extended Part; Datasheet: https://item.szlcsc.com/datasheet/XL-2012SURC/1051421.html; Supplier: LCSC; ConvertToPcb: yes; FootprintName: LED0805-RD_RED; ModelName: LED0805-RD_RED; Lamp Holder Type: 2mmx1.2mm方形灯头; Wavelength - Dominant: 615nm~630nm; Color Temperature: -; Mounting Style: 正贴; Operating Temperature: -40℃~+85℃
F1 = nsmd050-24v: 耐压(Vmax):24V;最大电流(Imax):100A;保持电流(Ihold):500mA;跳闸电流(Itrip):1A;; Manufacturer: 台湾陆海; AddInBom: yes; ModelId: f1628daad26847a79b887277a2bc8541; ModelName: F1206_L3.2-W1.7-H0.6; ModelTransform: 125.984,66.929,0,0,0,0,0,0,0; Voltage - Max: 24V; Current - Max: 100A; Hold Current: 500mA; Trip Current: 1A; Power Dissipation: 600mW; Resistance - Initial (Ri) (Min): 150mΩ; Resistance - Post Trip (R1) (Max): 700mΩ; Time to Trip(Max): 100ms; Symbol: nSMD050-24V; LCSC Part Name: 0.50A  24V 自恢复保险丝; SupplierPart: C70076; ManufacturerPart: nSMD050-24V; Supplier Footprint: 1206; JLCPCB Part Class: Extended Part; Datasheet: https://item.szlcsc.com/datasheet/nSMD050-24V/71171.html; Supplier: LCSC; ConvertToPcb: yes; FootprintName: F1206; Length: 3.5mm; Width: 1.8mm; Height: 1.4mm
J3 = db125-3.81-4p-gn-s: 结构:1x4P;间距:3.81mm;颜色:绿色;安装方式:直插;排数:1;每排PIN数:4;额定电流:10A;额定电压:300V;线规 - AWG:16~26;线规 - 平方毫米:1;工作温度:-40℃~+105℃;; Manufacturer: DORABO(地博电气); AddInBom: yes; ModelId: 11e8572fb837469c9a45098d5493725c; ModelName: CONN-TH_DB3.81-LI-4P-125; ModelTransform: 619.6736,291.338,0,180,0,0,11.811,-7.874,-157.48; Number of Positions or Pins: 1x4P; Pitch: 3.81mm; Number of PINs Per Row: 4; Screw Specification: M2; Current Rating: 10A; Voltage Rating (Max): 300V; Wire Gauge - AWG: 16~26; Wire Gauge - mm2: 1; Symbol: DB125-3.81-4P; LCSC Part Name: 1x4P 3.81mm 直插 排数:1 每排P数:4; SupplierPart: C395880; ManufacturerPart: DB125-3.81-4P-GN-S; Supplier Footprint: 插件,P=3.81mm; JLCPCB Part Class: Extended Part; Datasheet: https://item.szlcsc.com/datasheet/DB125-3.81-4P-GN-S/376627.html; Supplier: LCSC; ConvertToPcb: yes; FootprintName: CONN-TH_DB125-3.81-4P; Color: 绿色; Mounting Type: 直插; Number of Pins: 4P; Number of Rows: 1; Operating Temperature: -40℃~+105℃
L4 = fhd4020s-3r3mt: 电感值:3.3uH;精度:±20%;额定电流:4A;饱和电流(Isat):5.9A;类型:绕线电感;; Manufacturer: cjiang(长江微电); AddInBom: yes; ModelId: 45bc3737ecfd4f3bb122605ee525b018; ModelName: IND-SMD_L4.0-W4.0-H1.9; ModelTransform: 157.48,157.484,0,0,0,0,0,0,0; Value: 3.3uH; Tolerance: ±20%; Current Rating: 4A; Current - Saturation(Isat): 5.9A; DC Resistance(DCR): 73mΩ; Type: 绕线电感; Symbol: FHD4020S-3R3MT; LCSC Part Name: 3.3uH ±20% 5.9A; SupplierPart: C602030; ManufacturerPart: FHD4020S-3R3MT; Supplier Footprint: SMD,4x4mm; JLCPCB Part Class: Extended Part; Datasheet: https://atta.szlcsc.com/upload/public/pdf/source/20200609/C601990_BCEA243EC4DA0A9A288AA78A6DFB48A5.pdf; Supplier: LCSC; ConvertToPcb: yes; FootprintName: IND-SMD_L4.0-W4.0
P1 = zx-pm2.54-2-20py: 插孔结构:2x20P;间距:2.54mm;行距:2.54mm;圆孔/方孔:方孔;安装方式:直插;排数:双排;总孔位数:40P;额定电流:3A;额定电压:-;插孔方向:顶部;塑高:8.5mm;触头材质:黄铜;触头镀层:金;工作温度:-40℃~+105℃;; Manufacturer: Megastar(兆星); AddInBom: yes; ModelId: 6c85b3860eb24e43a9d123684eb6d3ee; ModelName: HDR-TH_40P-P2.54-F-LI-2X20P; ModelTransform: 2015.783,196.85,0,0,0,0,0,0,-125.984; Holes Structure: 2x20P; Pitch: 2.54mm; Circular Hole / Square Hole: 方孔; Number of Positions: 40P; Current Rating: 3A; Holes Direction: 顶部; PIN Length: 3.2mm; Symbol: ZX-PM2.54-2-20PY; LCSC Part Name: 2x20P 间距:2.54mm 直插; SupplierPart: C7499354; ManufacturerPart: ZX-PM2.54-2-20PY; Supplier Footprint: 插件,P=2.54mm; JLCPCB Part Class: Extended Part; Datasheet: https://item.szlcsc.com/datasheet/ZX-PM2.54-2-20PY/8574015.html; Supplier: LCSC; ConvertToPcb: yes; FootprintName: HDR-TH_40P-P2.54-V-F-R2-C20-S2.54; Row Spacing: 2.54mm; Mounting Type: 直插; Number of Rows: 双排; Voltage Rating (Max): -; Insulation Height: 8.5mm; Contact Material: 黄铜; Contact Plating: 金; Operating Temperature: -40℃~+105℃
Q1 = ao3407a_c15155: 数量:1个P沟道;漏源电压(Vdss):30V;连续漏极电流(Id):4.3A;导通电阻(RDS(on)):48mΩ@10V;耗散功率(Pd):-;阈值电压(Vgs(th)):2.5V@250uA;; Manufacturer: AOS; AddInBom: yes; ModelId: 89cb27a44ab2466697082bb9fd73a7d0; ModelName: SOT-23-3L_L2.9-W1.6-H1.1-LS2.8-P0.95; ModelTransform: 114.173,110.236,0,90,0,0,0,0,0; Number: 1个P沟道; Drain to Source Voltage: 30V; Current - Continuous Drain(Id): 4.3A; Gate Charge(Qg): 16nC@10V; Input Capacitance(Ciss): 830pF; Reverse Transfer Capacitance (Crss@Vds): 92pF@15V; Symbol: AO3407A; LCSC Part Name: 1个P沟道 耐压:30V 电流:4.3A; SupplierPart: C15155; ManufacturerPart: AO3407A; Supplier Footprint: SOT-23; JLCPCB Part Class: Extended Part; Datasheet: https://item.szlcsc.com/datasheet/AO3407A/15829.html; Supplier: LCSC; ConvertToPcb: yes; FootprintName: SOT-23-3_L2.9-W1.6-P1.90-LS2.8-BR; RDS(on): 48mΩ@10V; Pd - Power Dissipation: -; Gate Threshold Voltage (Vgs(th)): 2.5V@250uA; Operating Temperature: -; Configuration: -; Type: -; Output Capacitance(Coss): -
R64 R74 = R0603-100k: 0603,100k
R65 R87 R88 = R0603-5.1k: 0603,5.1k
R66 = R0603-16k: 0603,16k
R69 R75-R82 = R0603-1k: 0603,1k
R70 R71 = R0603-22Ω: 0603,22Ω
R72 = R0603-10k: 0603,10k
R73 = R0603-120Ω: 0603,120Ω
R89 = R0603-4.3k: 0603,4.3k
R90 = R0603-2k: 0603,2k
R91 = R0603-1Meg: 0603,1Meg
S4 = ss-12d10l5: as S3 on sheet F280025C_min_sys; Symbol: SS-12D10L5; LCSC Part Name: 柄长5mm 直插双档 滑动开关; SupplierPart: C319012; ManufacturerPart: SS-12D10L5; Supplier Footprint: 插件,13x6.8mm; JLCPCB Part Class: Extended Part; Datasheet: https://item.szlcsc.com/datasheet/SS-12D10L5/300104.html; Supplier: LCSC; ConvertToPcb: yes; FootprintName: SW-TH_SS-12D10L5; Termination Style: PC引脚; Length: 13mm; Width: 6.8mm; Mounting Type: 直插; Operating Temperature: -40℃~+85℃
S5 = xkb8080-z: 自锁/无锁:自锁;安装方式:直插;触点电流:100mA;额定电压:30V;带灯:不带;作用力:1.6N;工作寿命:10万次;; Manufacturer: XKB Connection(中国星坤); AddInBom: yes; ModelId: 2ca63b555ed647238a13c4f5c2920312; ModelName: SW-TH_L8.0-W8.0-H13.7-P2.5; ModelTransform: 314.96,314.96,0,90,0,0,0,0,-125.984; Self Lock / No Lock: 自锁; Actuator Style: 矩形按钮; Contact Current: 100mA; Voltage Rating: 30V; Actuator/Cap Color: 蓝色; With Lamp: 不带; Operating Force: 1.6N; Life: 10万次; Symbol: XKB8080-Z; LCSC Part Name: 8*8 蓝白黑 自锁开关; SupplierPart: C318860; ManufacturerPart: XKB8080-Z; Supplier Footprint: 插件; JLCPCB Part Class: Extended Part; Datasheet: https://item.szlcsc.com/datasheet/XKB8080-Z/299952.html; Supplier: LCSC; ConvertToPcb: yes; FootprintName: SW-TH_6P-L8.0-W8.0-P2.50; IP Rating: -; Mounting Type: 直插; Termination Style: PC引脚; Operating Temperature: -15℃~+55℃
TV1 = smbj15a_c83846: 极性:单向;反向截止电压(Vrwm):15V;钳位电压:24.4V;峰值脉冲电流(Ipp):24.6A;峰值脉冲功率(Ppp):600W;击穿电压(VBR):16.7V;; Manufacturer: Littelfuse(美国力特); AddInBom: yes; ModelId: 5e8926c661484ff2a35b83e5ae62aeb9; ModelTransform: 212.598,141.732,0,0,0,0,0,0,0; Polarity: 单向; Reverse Stand-Off Voltage (Vrwm): 15V; Clamping Voltage: 24.4V; Peak Pulse Current (Ipp): 24.6A; Peak Pulse Power Dissipation (Ppp): 600W; Voltage - Breakdown: 16.7V; Reverse Leakage Current (Ir): 1uA; level of protection: IEC 61000-4-4；IEC 61000-4-2; Symbol: SMBJ15A_C83846; LCSC Part Name: 单向TVS 15V截止 峰值浪涌电流：24.6A; SupplierPart: C83846; ManufacturerPart: SMBJ15A; Supplier Footprint: DO-214AA; JLCPCB Part Class: Extended Part; Datasheet: https://item.szlcsc.com/datasheet/SMBJ15A/85013.html; Supplier: LCSC; ConvertToPcb: yes; FootprintName: SMB_L4.6-W3.6-LS5.3-RD; ModelName: SMB_L4.6-W3.6-LS5.3-RD; Operating Temperature: -65℃~+150℃; Type: TVS
TV2 = pesd1can,215: 极性:双向;反向截止电压(Vrwm):24V;钳位电压:70V;峰值脉冲电流(Ipp):3A@8/20us;峰值脉冲功率(Ppp):200W@8/20us;击穿电压(VBR):27.8V;; Manufacturer: Nexperia(安世); AddInBom: yes; ModelId: c62791f0466c4ae2a892c056b845b0ca; ModelName: SOT-23-3P_L2.9-W1.3-H1.0-LS2.4-P0.95; ModelTransform: 98.64468,114.173,0,180,0,0,0.001,-0.002,0; Polarity: 双向; Reverse Stand-Off Voltage (Vrwm): 24V; Clamping Voltage: 70V; Voltage - Breakdown: 27.8V; Reverse Leakage Current (Ir): 1nA; Number of Channels: 双路; level of protection: IEC 61000-4-5；IEC 61000-4-2; Junction Capacitance: 11pF; Symbol: PESD1CAN,215; LCSC Part Name: 双向ESD 24V截止 峰值脉冲电流：3A@8/20us; SupplierPart: C15771; ManufacturerPart: PESD1CAN,215; Supplier Footprint: SOT-23; JLCPCB Part Class: Extended Part; Datasheet: https://item.szlcsc.com/datasheet/PESD1CAN%252C215/16453.html; Supplier: LCSC; ConvertToPcb: yes; FootprintName: SOT-23_L2.9-W1.3-P1.90-LS2.4-BR; Peak Pulse Current (Ipp): 3A@8/20us; Peak Pulse Power Dissipation (Ppp): 200W@8/20us; Operating Temperature: -65℃~+150℃; Type: ESD
U2 = tps62130rgtr: 功能类型:降压型;工作电压:3V~17V;输出电压:900mV~6V;输出电流:3A;输出类型:可调;; Manufacturer: TI(德州仪器); AddInBom: yes; ModelId: 4b11d3b5aea64910b85c54184b64922e; ModelName: QFN-16_L3.0-W3.0-P0.50-EP1.7; ModelTransform: 118.8974,118.8974,0,0,0,0,0,0,0; Function: 降压型; Voltage - Supply: 3V~17V; Output Current: 3A; Frequency - Switching: 2.5MHz; Synchronous Rectifier: 是; Number of Outputs: 1; Topology: 降压式; Quiescent Current: 17uA; Switch tube (built-in/external): 内置; Output Type: 可调; Symbol: TPS62130RGTR; LCSC Part Name: 降压型 3A 3V~17V; SupplierPart: C43590; ManufacturerPart: TPS62130RGTR; Supplier Footprint: QFN-16-EP(3x3); JLCPCB Part Class: Extended Part; Datasheet: https://www.ti.com/cn/lit/ds/symlink/tps62130.pdf; Supplier: LCSC; ConvertToPcb: yes; FootprintName: QFN-16_L3.0-W3.0-P0.50-TL-EP1.7; Output Voltage: 900mV~6V; Operating Temperature: -40℃~+85℃@(TA); Features: 轻载高效模式；可调软启动；过流保护；输出电压跟随；工作状态指示
U4 = tcan3413dr: 类型:CAN-FD收发器;数据速率:5Mbps;; Manufacturer: TI(德州仪器); AddInBom: yes; ModelId: 75c24a7891ee4dd6bdac16a7163ff87e; ModelTransform: 192.913,236.22,0,0,0,0,0,0,0; Data Rate: 5Mbps; Voltage - Supply: 3V~3.6V; Current - Supply: 42mA; Supply Current (Iq): 4uA; Symbol: TCAN3413DR; LCSC Part Name: TCAN3413 3.3-V CAN FD 收发器; SupplierPart: C22433320; ManufacturerPart: TCAN3413DR; Supplier Footprint: SOIC-8; JLCPCB Part Class: Extended Part; Datasheet: https://www.ti.com.cn/cn/lit/ds/symlink/tcan3413.pdf?ts=1739433172079&ref_url=https%253A%252F%252Fwww.ti.com.cn%252Fsitesearch%252Fzh-cn%252Fdocs%252Funiversalsearch.tsp%253FlangPref%253Dzh-CN%2526nr%253D19%2526searchTerm%253DTCAN3413DR; Supplier: LCSC; ConvertToPcb: yes; FootprintName: SOP-8_L4.9-W3.9-P1.27-LS6.0-BL-1; ModelName: SOP-8_L4.9-W3.9-P1.27-LS6.0-BL-1; Type: CAN-FD收发器; Operating Temperature: -40℃~+125℃
USB1 = type-c 16p cb1.6 073: 连接器类型:Type-C;协议标准:USB 3.1;公母:母;安装方式:沉板;触点数量:16P;端口数量:1;额定电流 - 电源:3A;工作温度:-25℃~+85℃;; Manufacturer: SHOU HAN(首韩); AddInBom: yes; ModelId: 26f34bb6c6bf4f1dbd42510d10f41fd6; ModelTransform: 454.33,283.464,0,0,0,0,0,-42.322,-62.992; Protocol Standard: USB 3.1; Gender: 母; Number of Ports: 1; Current Rating-Power: 3A; Voltage Rating: 5V; Connect-Disconnect Life: 5千次; Detection color: 黑色; Symbol: TYPE-C 16P CB1.6 073; LCSC Part Name: 16P沉板母座; SupplierPart: C2906290; ManufacturerPart: TYPE-C 16P CB1.6 073; Supplier Footprint: SMD; JLCPCB Part Class: Extended Part; Datasheet: https://item.szlcsc.com/datasheet/TYPE-C%252016P%2520CB1.6%2520073/3179000.html; Supplier: LCSC; ConvertToPcb: yes; FootprintName: USB-C-SMD_SHOU_TYPE-C-16P-CB1.6; ModelName: USB-C-SMD_SHOU_TYPE-C-16P-CB1.6; Connector Type: Type-C; Mounting Type: 沉板; Number of Contacts: 16P; Operating Temperature: -25℃~+85℃

## Nets that join several sheets
+3V3: F280025C_min_sys (14 pins), sys-part2 (8 pins)
GND: F280025C_min_sys (70 pins), sys-part2 (49 pins)
VDDIO: F280025C_min_sys (22 pins), sys-part2 (14 pins)
CANA_RX: F280025C_min_sys (U1.60), sys-part2 (R70.2 TP102.1)
CANA_TX: F280025C_min_sys (U1.61), sys-part2 (R71.2 TP103.1)
EPWM-1A: F280025C_min_sys (U1.1), sys-part2 (P1.11 TP105.1)
EPWM-1B: F280025C_min_sys (U1.2), sys-part2 (P1.13 TP106.1)
EPWM-3A: F280025C_min_sys (U1.79), sys-part2 (P1.9 TP109.1)
EPWM-3B: F280025C_min_sys (U1.78), sys-part2 (P1.7 TP110.1)
EPWM-7A: F280025C_min_sys (U1.4), sys-part2 (P1.17 TP107.1)
EPWM-7B: F280025C_min_sys (U1.3), sys-part2 (P1.15 TP108.1)
GPIO0: F280025C_min_sys (U1.63), sys-part2 (LED1.1 TP145.1)
GPIO1: F280025C_min_sys (U1.62), sys-part2 (LED0.1 TP144.1)
GPIO7: F280025C_min_sys (U1.68), sys-part2 (LED6.1 TP150.1)
GPIO11: F280025C_min_sys (U1.37), sys-part2 (P1.27 TP118.1)
GPIO12: F280025C_min_sys (U1.36), sys-part2 (P1.30)
GPIO13: F280025C_min_sys (U1.35), sys-part2 (P1.29 TP120.1)
GPIO22: F280025C_min_sys (U1.67), sys-part2 (LED5.1 TP149.1)
GPIO23: F280025C_min_sys (U1.65), sys-part2 (LED3.1 TP147.1)
GPIO33: F280025C_min_sys (U1.38), sys-part2 (P1.28 TP119.1)
GPIO40: F280025C_min_sys (U1.64), sys-part2 (LED2.1 TP146.1)
GPIO41: F280025C_min_sys (U1.66), sys-part2 (LED4.1 TP148.1)
GPIO44: F280025C_min_sys (U1.69), sys-part2 (LED7.1 TP151.1)
Iin_FB: F280025C_min_sys (R14.2 TP39.1), sys-part2 (P1.23)
IL_FB: F280025C_min_sys (R27.2 TP47.1), sys-part2 (P1.19)
SPIB_CLK: F280025C_min_sys (U1.43), sys-part2 (P1.34 TP124.1)
SPIB_SIMO: F280025C_min_sys (U1.41), sys-part2 (P1.32 TP122.1)
SPIB_SOMI: F280025C_min_sys (U1.42), sys-part2 (P1.31 TP123.1)
SPIB_STE: F280025C_min_sys (U1.44), sys-part2 (P1.33 TP125.1)
Vin_FB: F280025C_min_sys (R15.2 TP40.1), sys-part2 (P1.21)
Vo_FB: F280025C_min_sys (R18.2 TP42.1), sys-part2 (P1.25)